# EAGLE design v1 (EAGLE 9.6.2)
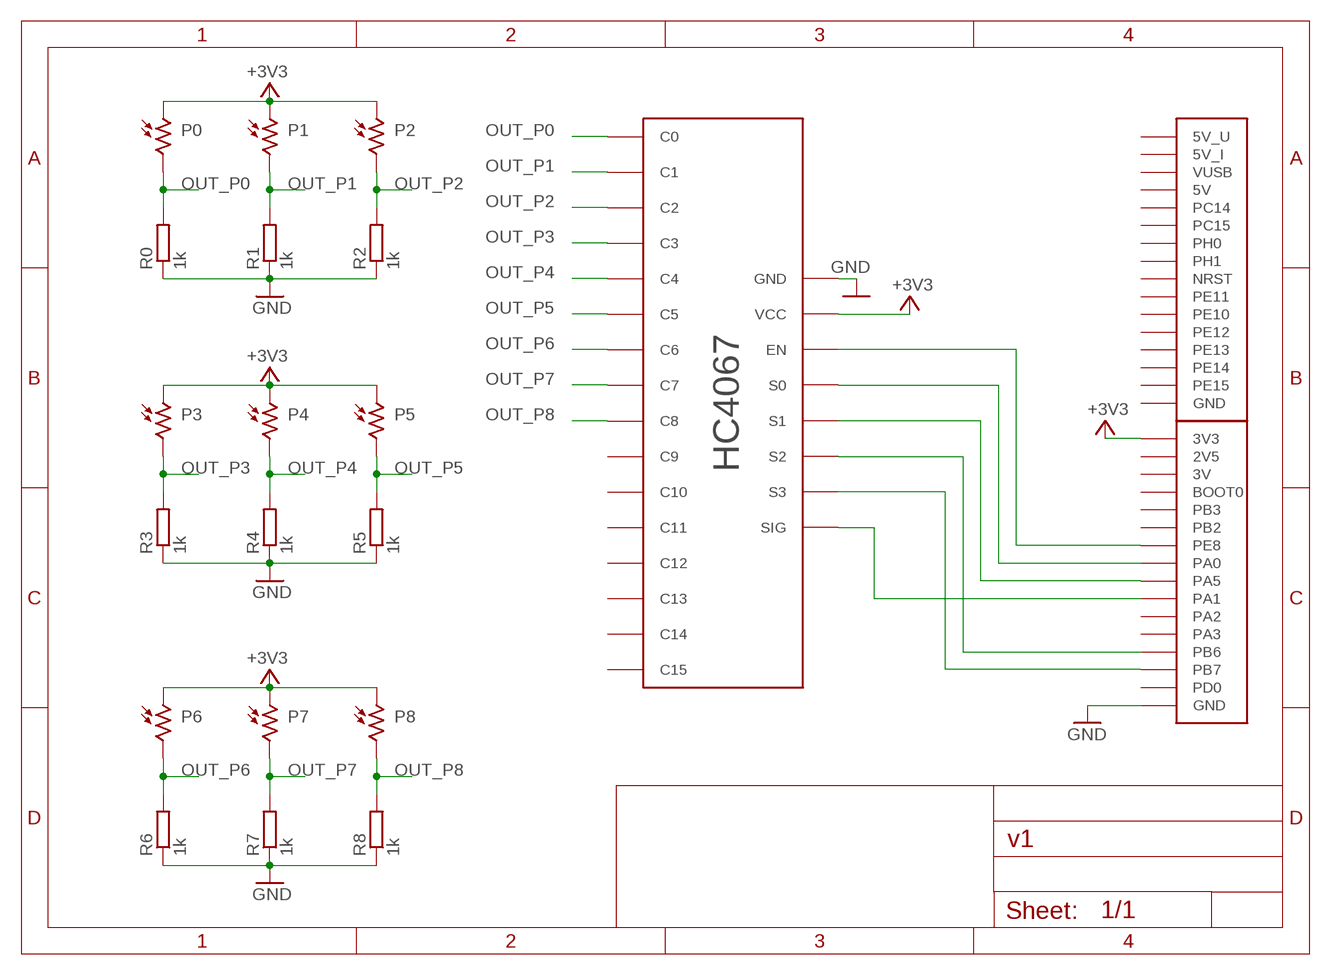
[diagram p0: schematic, sheet 1]

## Parts
P0  PHOTORESISTOR  [PHOTORESISTOR]
P1  PHOTORESISTOR  [PHOTORESISTOR]
P2  PHOTORESISTOR  [PHOTORESISTOR]
P3  PHOTORESISTOR  [PHOTORESISTOR]
P4  PHOTORESISTOR  [PHOTORESISTOR]
P5  PHOTORESISTOR  [PHOTORESISTOR]
P6  PHOTORESISTOR  [PHOTORESISTOR]
P7  PHOTORESISTOR  [PHOTORESISTOR]
P8  PHOTORESISTOR  [PHOTORESISTOR]
R0  1k  R-EU_0207/10  [0207/10]
R1  1k  R-EU_0207/10  [0207/10]
R2  1k  R-EU_0207/10  [0207/10]
R3  1k  R-EU_0207/10  [0207/10]
R4  1k  R-EU_0207/10  [0207/10]
R5  1k  R-EU_0207/10  [0207/10]
R6  1k  R-EU_0207/10  [0207/10]
R7  1k  R-EU_0207/10  [0207/10]
R8  1k  R-EU_0207/10  [0207/10]
U$1  STM32L476_DISCOVERY  [STM32L476_DISCOVERY]
U$2  HC4067_BREAKOUT_BOARD  [ANALOG_MUX_BREAKOUT_HC4067]

## Nets
+3V3: P0.P1 P1.P1 P2.P1 P3.P1 P4.P1 P5.P1 P6.P1 P7.P1 P8.P1 U$1.3V3(STM32L476_DISCOVERY_L:3V3)
GND: R0.1 R1.1 R2.1 R3.1 R4.1 R5.1 R6.1 R7.1 R8.1 U$1.GND_1(STM32L476_DISCOVERY_L:GND) U$1.GND_2(STM32L476_DISCOVERY_L:GND) U$1.GND_3(STM32L476_DISCOVERY_L:GND) U$1.GND_4(STM32L476_DISCOVERY_L:GND) U$2.GND
N$10: U$1.PE8(STM32L476_DISCOVERY_L:PE8) U$2.EN
N$11: U$1.PA0(STM32L476_DISCOVERY_L:PA0) U$2.S0
N$12: U$1.PA5(STM32L476_DISCOVERY_L:PA5) U$2.S1
N$13: U$1.PB6(STM32L476_DISCOVERY_L:PB6) U$2.S2
N$14: U$1.PB7(STM32L476_DISCOVERY_L:PB7) U$2.S3
N$15: U$1.PA1(STM32L476_DISCOVERY_L:PA1) U$2.SIG
OUT_P0: P0.P2 R0.2 U$2.C0
OUT_P1: P1.P2 R1.2 U$2.C1
OUT_P2: P2.P2 R2.2 U$2.C2
OUT_P3: P3.P2 R3.2 U$2.C3
OUT_P4: P4.P2 R4.2 U$2.C4
OUT_P5: P5.P2 R5.2 U$2.C5
OUT_P6: P6.P2 R6.2 U$2.C6
OUT_P7: P7.P2 R7.2 U$2.C7
OUT_P8: P8.P2 R8.2 U$2.C8
VCC: U$2.VCC ; supply symbol labelled +3V3
Unconnected: U$1.5V(STM32L476_DISCOVERY_R:5V) U$1.BOOT0(STM32L476_DISCOVERY_L:BOOT0) U$1.GND_5(STM32L476_DISCOVERY_R:GND) U$1.GND_6(STM32L476_DISCOVERY_R:GND) U$1.GND_7(STM32L476_DISCOVERY_R:GND) U$1.GND_8(STM32L476_DISCOVERY_R:GND) U$1.GND_9(STM32L476_DISCOVERY_R:GND) U$1.NC(STM32L476_DISCOVERY_L:NC) U$1.NRST(STM32L476_DISCOVERY_R:NRST) U$1.PA2(STM32L476_DISCOVERY_L:PA2) U$1.PA3(STM32L476_DISCOVERY_L:PA3) U$1.PB2(STM32L476_DISCOVERY_L:PB2) U$1.PB3(STM32L476_DISCOVERY_L:PB3) U$1.PC14(STM32L476_DISCOVERY_R:PC14) U$1.PC15(STM32L476_DISCOVERY_R:PC15) U$1.PD0(STM32L476_DISCOVERY_L:PD0) U$1.PE10(STM32L476_DISCOVERY_R:PE10) U$1.PE11(STM32L476_DISCOVERY_R:PE11) U$1.PE12(STM32L476_DISCOVERY_R:PE12) U$1.PE13(STM32L476_DISCOVERY_R:PE13) U$1.PE14(STM32L476_DISCOVERY_R:PE14) U$1.PE15(STM32L476_DISCOVERY_R:PE15) U$1.PH0(STM32L476_DISCOVERY_R:PH0) U$1.PH1(STM32L476_DISCOVERY_R:PH1) U$2.C9 U$2.C10 U$2.C11 U$2.C12 U$2.C13 U$2.C14 U$2.C15

## Power pins joined to a net without a drawn wire
2V5: U$1.2V5(STM32L476_DISCOVERY_L:2V5)
3V: U$1.3V(STM32L476_DISCOVERY_L:3V)
5V_I: U$1.5V_I(STM32L476_DISCOVERY_R:5V_I)
5V_U: U$1.5V_U(STM32L476_DISCOVERY_R:5V_U)
VUSB: U$1.VUSB(STM32L476_DISCOVERY_R:VUSB)

## Library data of the parts
P0 P1-P8 = wlasne:PHOTORESISTOR
R0 R1-R8 = rcl:R-EU_: RESISTOR, European symbol; SPICEPREFIX: R
U$1 = wlasne:STM32L476_DISCOVERY
U$2 = hp:HC4067_BREAKOUT_BOARD

## Board
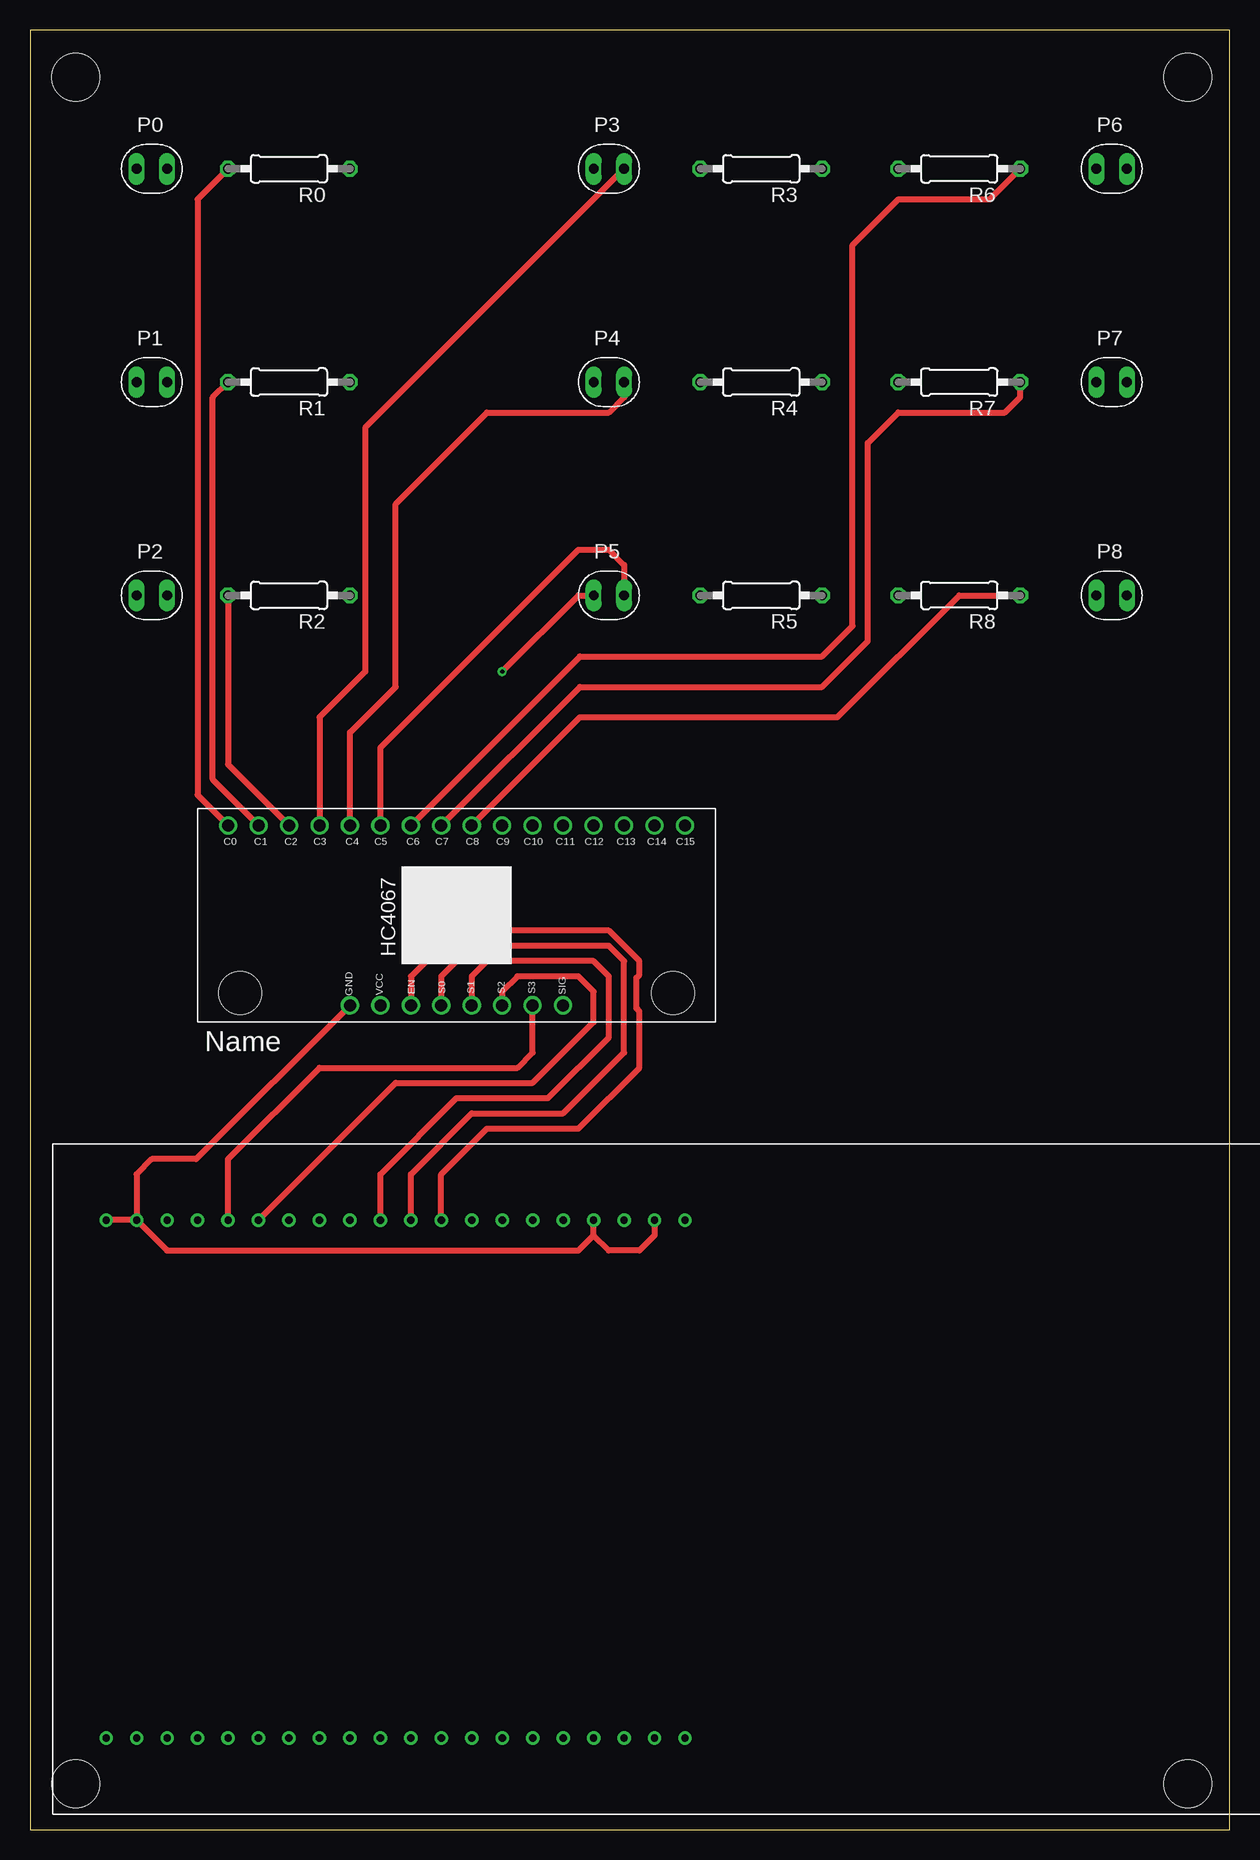
[diagram p1: board, top side]
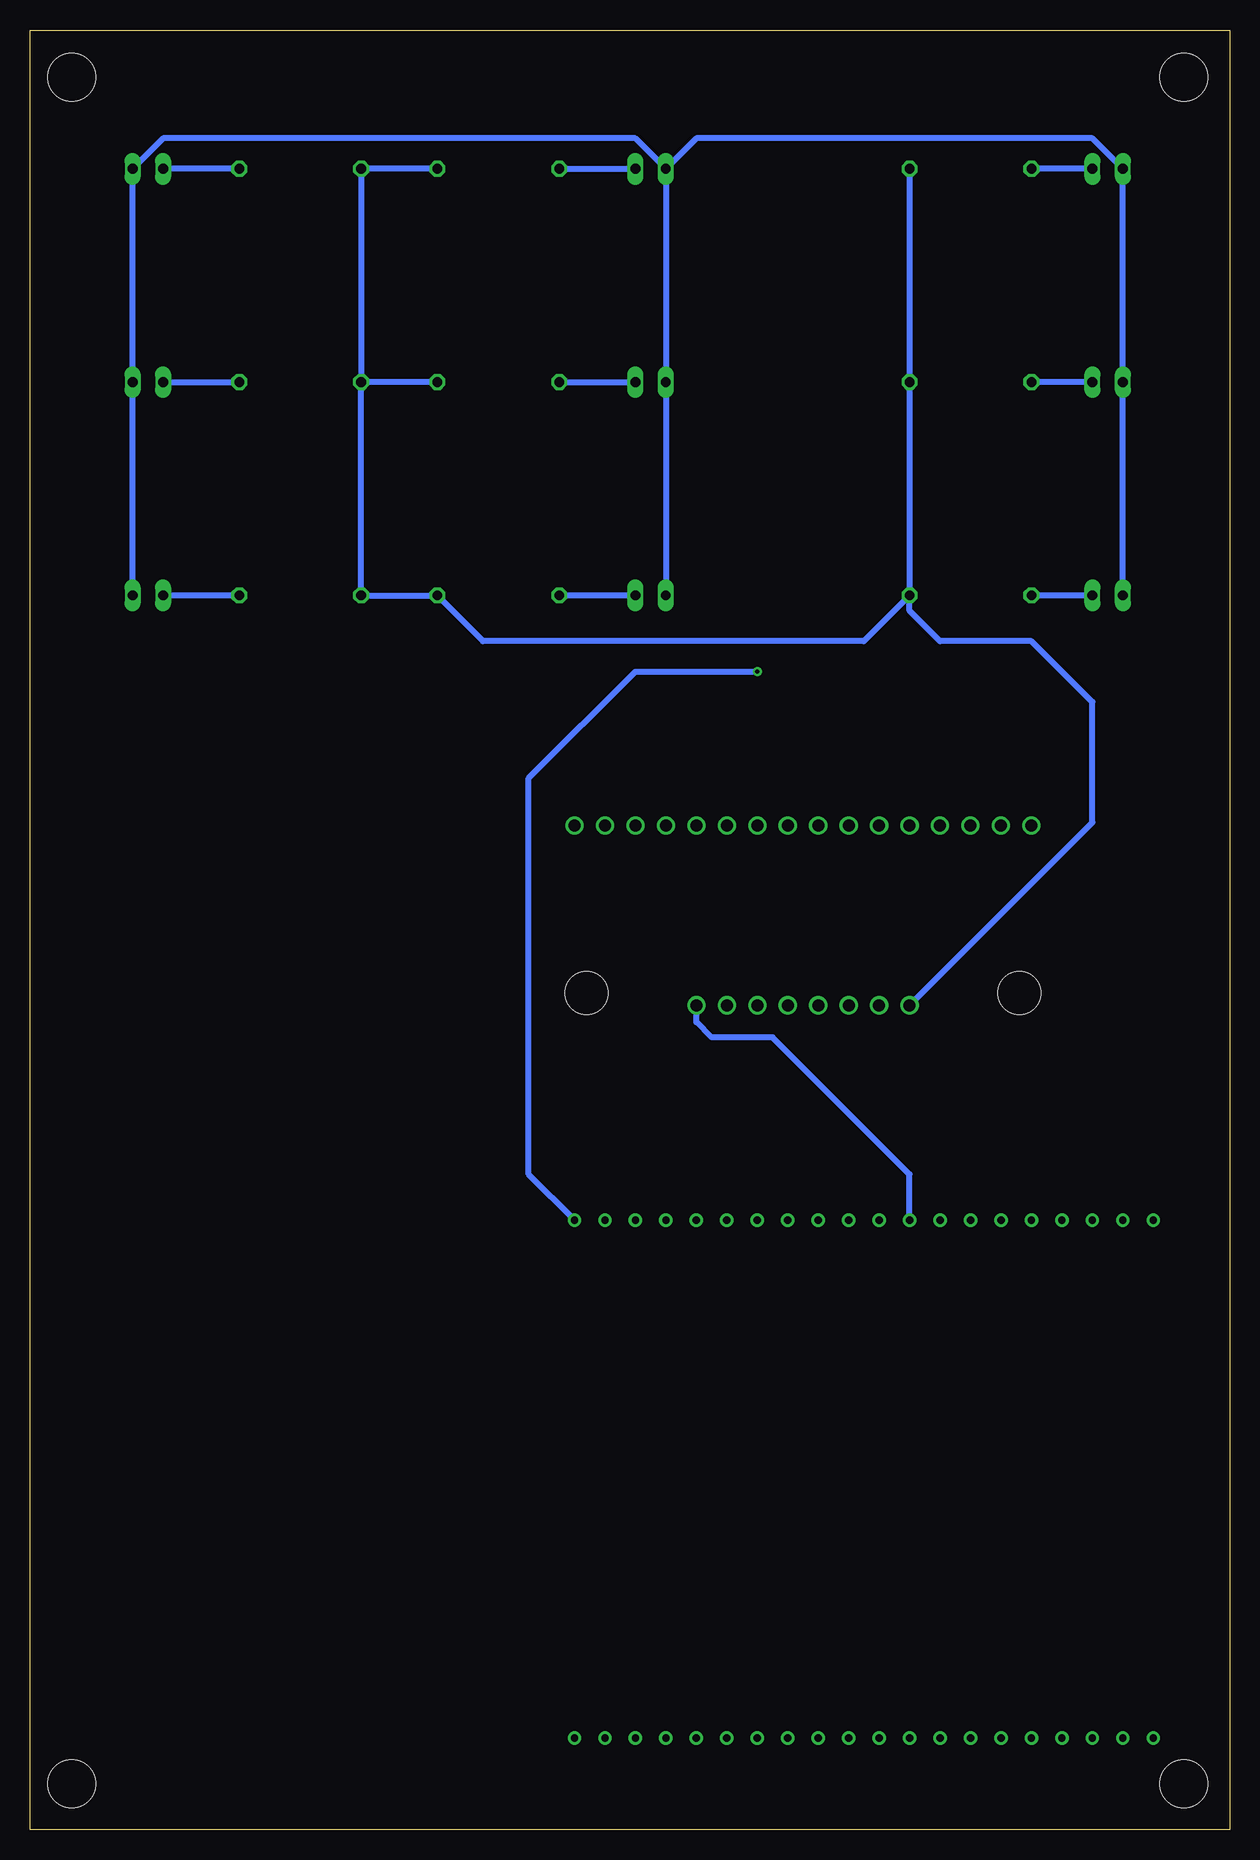
[diagram p2: board, bottom side, seen from below]

Size 100 x 150 mm. Coordinates in mm from the lower left corner, seen from the top.
Outline: 0,0 100,0 100,150 0,150 0,0
Copper layers (1*16): Top 0.035mm / dielectric 1.5mm / Bottom 0.035mm
Design rules "default": minimum track width 6mil, minimum drill 0.35mm, track to track 6mil, track to pad 6mil, pad to pad 6mil, via to via 6mil, smd to smd 6mil, copper to edge 40mil, drill to drill 6mil, minimum pad ring 10mil, minimum via ring 8mil, stop-mask expansion 4mil, vias tented up to drill 0mil, thermal gap 10mil
Holes 4 mm at 3.81,3.81 96.52,3.81 3.81,146.05 96.52,146.05

### Footprints (pad centres in the part's own frame; a part is rotated, then mirrored left to right if it is on the bottom)
PHOTORESISTOR = drill 0.813 long: P1 -1.27,0; P2 1.27,0
0207/10 = drill 0.813 octagon: 1 -5.08,0; 2 5.08,0
STM32L476_DISCOVERY = drill 0.6: 2V5 0,43.18; 3V 0,38.1; 3V3 0,48.26; 5V 43.18,38.1; 5V_I 43.18,43.18; 5V_U 43.18,48.26; BOOT0 0,35.56; GND_1 0,0; GND_2 0,2.54; GND_3 0,40.64; GND_4 0,45.72; GND_5 43.18,0; GND_6 43.18,2.54; GND_7 43.18,20.32; GND_8 43.18,35.56; GND_9 43.18,45.72; NC 0,5.08; NRST 43.18,22.86; PA0 0,25.4; PA1 0,20.32; PA2 0,17.78; PA3 0,15.24; PA5 0,22.86; PB2 0,30.48; PB3 0,33.02; PB6 0,12.7; PB7 0,10.16; PC14 43.18,33.02; PC15 43.18,30.48; PD0 0,7.62; PE8 0,27.94; PE10 43.18,15.24; PE11 43.18,17.78; PE12 43.18,12.7; PE13 43.18,10.16; PE14 43.18,7.62; PE15 43.18,5.08; PH0 43.18,27.94; PH1 43.18,25.4; VUSB 43.18,40.64
ANALOG_MUX_BREAKOUT_HC4067 = drill 1: C0 19.05,-7.493; C1 16.51,-7.493; C2 13.97,-7.493; C3 11.43,-7.493; C4 8.89,-7.493; C5 6.35,-7.493; C6 3.81,-7.493; C7 1.27,-7.493; C8 -1.27,-7.493; C9 -3.81,-7.493; C10 -6.35,-7.493; C11 -8.89,-7.493; C12 -11.43,-7.493; C13 -13.97,-7.493; C14 -16.51,-7.493; C15 -19.05,-7.493; EN 3.81,7.493; GND 8.89,7.493; S0 1.27,7.493; S1 -1.27,7.493; S2 -3.81,7.493; S3 -6.35,7.493; SIG -8.89,7.493; VCC 6.35,7.493 | hole 3.556: 18.034,6.477; -18.034,6.477

### Placement (x,y rotation side)
P0  10.16,138.43 0 top
P1  10.16,120.65 0 top
P2  10.16,102.87 0 top
P3  48.26,138.43 0 top
P4  48.26,120.65 0 top
P5  48.26,102.87 0 top
P6  90.17,138.43 180 top
P7  90.17,120.65 180 top
P8  90.17,102.87 180 top
R0  21.59,138.43 180 top
R1  21.59,120.65 180 top
R2  21.59,102.87 180 top
R3  60.96,138.43 180 top
R4  60.96,120.65 180 top
R5  60.96,102.87 180 top
R6  77.47,138.43 0 top
R7  77.47,120.65 0 top
R8  77.47,102.87 0 top
U$1  6.35,50.8 270 top
U$2  35.56,76.2 180 top

### Tracks (layer width: path | path; a pad name or v marks a point on that pad's centre or on a via)
+3V3  (via drill 0.35)
  Top 0.508: v39.37,96.52 45.72,102.87 P5.P1
  Bottom 0.508: P8.P1 P7.P1 P6.P1 88.9,140.97 49.53,140.97 P3.P1 | P2.P1 P1.P1 P0.P1 11.43,140.97 44.45,140.97 P3.P1 | P3.P1 P4.P1 P5.P1 | U$1.3V3 58.42,54.61 58.42,87.63 49.53,96.52 v39.37,96.52
GND
  Top 0.508: U$2.GND 13.84,55.88 10.16,55.88 8.89,54.61 U$1.GND_2 | U$1.GND_2 U$1.GND_1 | U$1.GND_4 52.07,49.53 50.8,48.26 48.26,48.26 46.99,49.53 | U$1.GND_2 11.43,48.26 45.72,48.26 46.99,49.53 | 46.99,49.53 U$1.GND_3
  Bottom 0.508: R4.1 R7.1 | R3.1 R6.1 R7.1 | R7.1 R8.1 R5.1 62.23,99.06 30.48,99.06 R2.1 | R0.1 R1.1 R2.1 | U$2.GND 11.43,83.95 11.43,93.98 16.51,99.06 24.13,99.06 26.67,101.6 R2.1
N$10
  Top 0.508: U$1.PE8 34.29,54.61 38.1,58.42 45.72,58.42 50.8,63.5 50.8,68.21 50.55,68.46 50.55,70.99 50.8,71.24 50.8,72.39 48.26,74.93 35.56,74.93 31.75,71.12 U$2.EN
N$11
  Top 0.508: U$1.PA0 31.75,54.61 36.83,59.69 44.45,59.69 49.53,64.77 49.53,72.39 48.26,73.66 36.83,73.66 34.29,71.12 U$2.S0
N$12
  Top 0.508: U$1.PA5 29.21,54.61 35.56,60.96 43.18,60.96 48.26,66.04 48.26,71.12 46.99,72.39 38.1,72.39 36.83,71.12 U$2.S1
N$13
  Top 0.508: U$1.PB6 30.48,62.23 41.91,62.23 46.99,67.31 46.99,69.85 45.72,71.12 40.64,71.12 39.37,69.85 U$2.S2
N$14
  Top 0.508: U$1.PB7 16.51,55.88 24.13,63.5 40.64,63.5 41.91,64.77 U$2.S3
N$15
  Bottom 0.508: U$1.PA1 26.67,54.61 38.1,66.04 43.18,66.04 44.45,67.31 U$2.SIG
OUT_P0
  Top 0.508: R0.2 13.97,135.89 13.97,86.23 U$2.C0
  Bottom 0.508: P0.P2 R0.2
OUT_P1
  Top 0.508: U$2.C1 15.24,87.5 15.24,119.38 R1.2
  Bottom 0.508: P1.P2 R1.2
OUT_P2
  Top 0.508: U$2.C2 16.51,88.77 R2.2
  Bottom 0.508: P2.P2 R2.2
OUT_P3
  Top 0.508: P3.P2 27.94,116.84 27.94,96.52 24.13,92.71 U$2.C3
  Bottom 0.508: R3.2 P3.P2
OUT_P4
  Top 0.508: U$2.C4 26.67,91.44 30.48,95.25 30.48,110.49 38.1,118.11 48.26,118.11 49.53,119.38 P4.P2
  Bottom 0.508: R4.2 P4.P2
OUT_P5
  Top 0.508: U$2.C5 29.21,90.17 45.72,106.68 48.26,106.68 49.53,105.41 P5.P2
  Bottom 0.508: P5.P2 R5.2
OUT_P6
  Top 0.508: U$2.C6 45.85,97.79 66.04,97.79 68.58,100.33 68.58,132.08 72.39,135.89 80.01,135.89 R6.2
  Bottom 0.508: R6.2 P6.P2
OUT_P7
  Top 0.508: U$2.C7 45.85,95.25 66.04,95.25 69.85,99.06 69.85,115.57 72.39,118.11 81.28,118.11 82.55,119.38 R7.2
  Bottom 0.508: P7.P2 R7.2
OUT_P8
  Top 0.508: U$2.C8 45.85,92.71 67.31,92.71 77.47,102.87 R8.2
  Bottom 0.508: R8.2 P8.P2